# Altium schematic sheet Power.SchDoc
size A
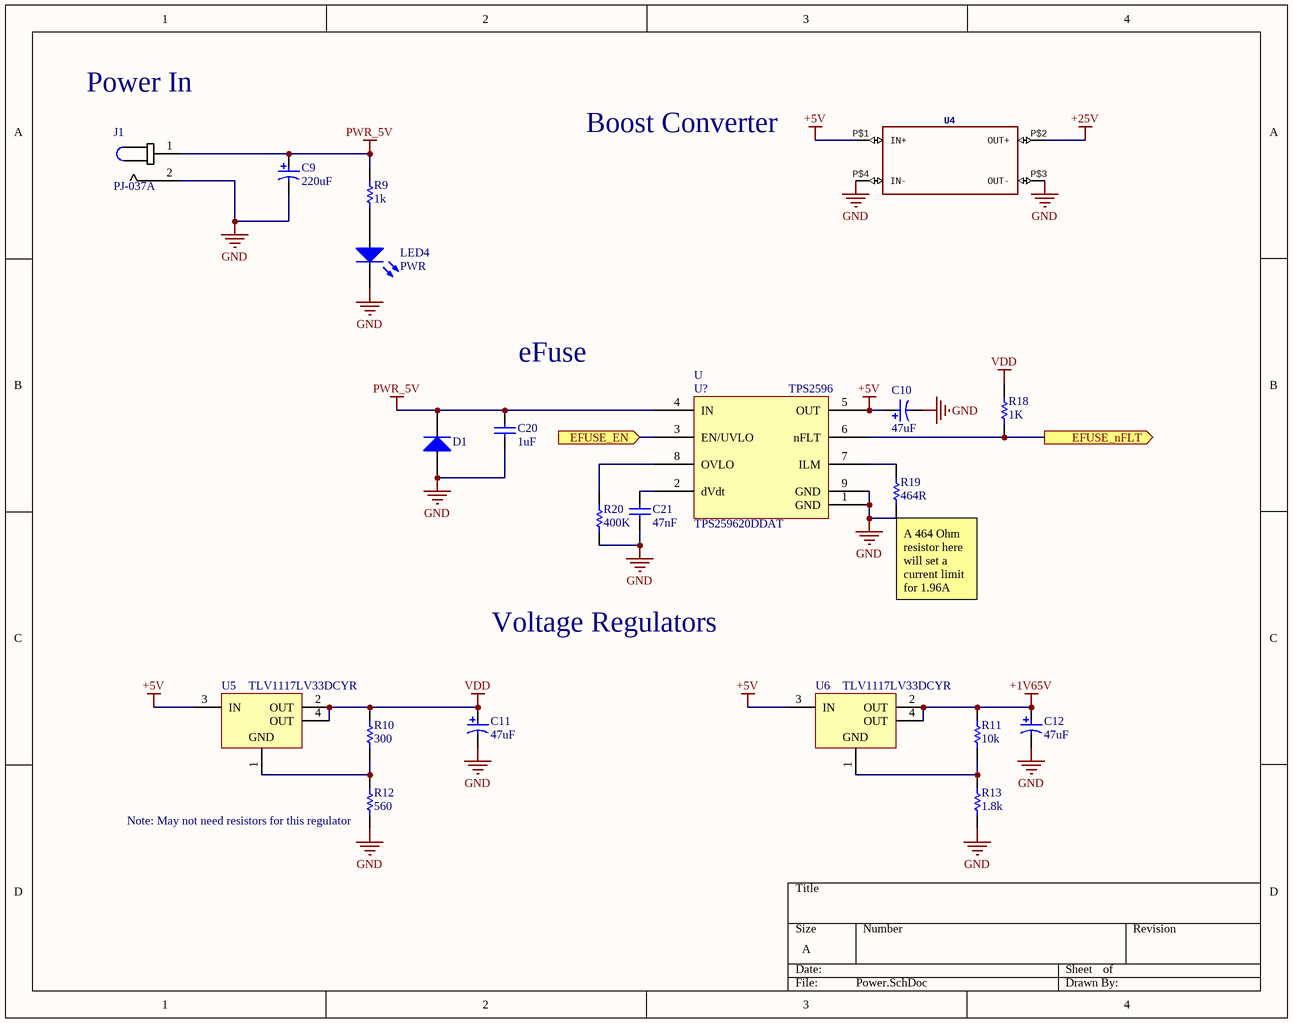
[diagram p0: Power.SchDoc]

## Parts
C9  220uF  [PNSC-FP-V-F_V]
C10  47uF  [PNSC-FP-V-D_V]
C11  47uF  [PNSC-FP-V-D_V]
C12  47uF  [PNSC-FP-V-D_V]
C20  1uF  [CAPC1608X90X20LL10]
C21  47nF  [CAPC1608X90X35ML10T15]
D1  SMAJ5.0A-E3/61  [VISH-DO-214AC-2_M]  (value not drawn)
J1  PJ-037A  [*CUI_PJ-037A]
LED4  PWR  [0805_A]
R9  1k  [RESC1608X55X30LL20T20]
R10  300  [RESC1608X55X30LL15T15]
R11  10k  [RESC1608X55X30LL15T15]
R12  560  [RESC1608X55X30LL20T20]
R13  1.8k  [RESC1609X50X30NL10T20]
R18  1K  [RESC1608X55X30LL15T15]
R19  464R  [RESC1608X55X30LL15T15]
R20  400K  [RESC1608X55X30LL15T15]
U  TPS259620DDAT  [TPS259620DDAT - duplicate]
U4  XL6009E1  [XL6009E1]  (value not drawn)
U5  TLV1117LV33DCYR  [DCY0004A_M]
U6  TLV1117LV33DCYR  [DCY0004A_M]

## Ports
EFUSE_EN (in), EFUSE_nFLT (out)

## Nets
+1V65V: C12.1 R11.2 U6.2(OUT) U6.4(OUT)
+5V: C10.1 U.5(OUT) U4.P$1(IN+) U5.3(IN) U6.3(IN)
+25V: U4.P$2(OUT+)
GND: C9.2 C10.2 C11.2 C12.2 C20.1 C21.1 D1.2(A) J1.2 LED4.1(K) R12.1 R13.2 R19.1 R20.1 U.1(GND) U.9(GND) U4.P$3(OUT-) U4.P$4(IN-)
PWR_5V: C9.1 C20.2 D1.1(K) J1.1 R9.2 U.4(IN)
VDD: C11.1 R10.2 R18.2 U5.2(OUT) U5.4(OUT)
EFUSE_EN: U.3(EN/UVLO) ; port EFUSE_EN
EFUSE_nFLT: R18.1 U.6(nFLT) ; port EFUSE_nFLT
NetC21_2: C21.2 U.2(dVdt)
NetLED4_2: LED4.2(A) R9.1
NetR10_1: R10.1 R12.2 U5.1(GND)
NetR11_1: R11.1 R13.1 U6.1(GND)
NetR19_2: R19.2 U.7(ILM)
NetR20_2: R20.2 U.8(OVLO)

## Notes on the sheet
- Power In
- Boost Converter
- eFuse
- Voltage Regulators
- (near R19) A 464 Ohm resistor here will set a current limit for 1.96A
- (near R12) Note: May not need resistors for this regulator
- (in symbol TI_TPS259620DDAT) U?; TPS2596

## Library data of the parts
C9 = CMP-2000-06215-1: Aluminum Electrolytic Capacitor, 220 uF, +/- 20%, 35 V, 2-Pin SMD (Size Code F), -55 to 105 degC, RoHS, Tape and Reel; Manufacturer: Panasonic; ESR: 0.08ohm; Ripple Current AC: 850mA; Capacitance: 220µF; External Length / Height: 10.2mm; SVHC: ToBeAdvised; Life Time @ Temperature: 2000hours@105°C; Voltage Rating: 35V; Capacitor Case Style: RadialCan-SMD; Leakage Current: 7.7µA; Product Range: PANASONIC-FPSeries; Diameter: 8mm; Datasheet URL: http://industrial.panasonic.com/cdbs/www-data/pdf/RDE0000/ABA0000C1184.pdf; Manufacturer URL: http://www.panasonic.com/; Series: FP; Operating Temperature Max: 105°C; Package Description: 2-Pin Electrolytic Aluminum Capacitor, Body 8.3 x 8.3 mm; Package Reference: FP-V-F; Lifetime @ Temperature: 2000hours@105°C; Operating Temperature Range: -55°Cto+105°C; Package URL: http://industrial.panasonic.com/cdbs/www-data/pdf/RDE0000/DME0000COL48.pdf; Capacitance Tolerance ±: ±20%; AE Capacitor Case: RadialCan-SMD; Height: 10.2mm; Mounting Technology: SurfaceMount; Datasheet Version: 03/2016; Packaging: CutTape; Operating Temperature Min: -55°C; Capacitance Tolerance: ±20%
C10-C12 = CMP-2000-06216-1: Aluminum Electrolytic Capacitor, 47 uF, +/- 20%, 35 V, 2-Pin SMD (Size Code D), -55 to 105 degC, RoHS, Tape and Reel; Manufacturer: Panasonic; Lifetime@Temperature: 2000Hrs@105°C; Capacitance: 47µF; Type: Can; Rated Voltage: 35V; Ripple Current: 300mA; ESR (Equivalent Series Resistance): 0.26O; Package Reference: FP-V-D; Package Description: 2-Pin Electrolytic Aluminum Capacitor, Body 6.6 x 6.6 mm; Datasheet URL: http://industrial.panasonic.com/cdbs/www-data/pdf/RDE0000/ABA0000C1184.pdf; Series: FP; Operating Temp Range: -55to+105°C; Operating Temp-Max: 105°C; Datasheet Version: 03/2016; Manufacturer URL: http://www.panasonic.com/; Package URL: http://industrial.panasonic.com/cdbs/www-data/pdf/RDE0000/DME0000COL48.pdf; Case Size/Dimension: Ø6.3x5.8mm; Mounting Technology: SurfaceMount
C20 = CMP-2000-06025-1: Chip Capacitor, 1 uF, +/- 10%, 50 V, -55 to 85 degC, 0603 (1608 Metric), RoHS, Tape and Reel; Manufacturer: TDK; PCN Part Number: MLCCPartNumberChange30/Nov/2012; Other Names: 445-7468-6; Online Catalog: CSeries,GeneralPurpose; Capacitance: 1µF; Product Training Modules: CSeriesGeneralApplicationsSEAT,CCV,andTVCLDesignToolsGuidetoReplacinganElectrolyticCapacitorwithanMLCC; Voltage - Rated: 50V; Design Resources: 20WNon-IsolatedBuckLEDDriverUsingPLLNK460KG; Temperature Coefficient: X5R; Series: C; Datasheet Version: 08/2016; Package Description: 2-Pin Surface Mount Device, Body 1.6 x 0.8 mm; Mounting Technology: SurfaceMount; Features: -; Size / Dimension: 0.063"Lx0.031"W(1.60mmx0.80mm); Lead Spacing: -; Operating Temperature: -55°C~85°C; Tolerance: ±10%; Height - Seated (Max): -; Mounting Type: SurfaceMount,MLCC; Ratings: -; Standard Package: 1; Applications: GeneralPurpose; Datasheet URL: https://product.tdk.com/info/en/catalog/datasheets/mlcc_commercial_general_en.pdf; Category: Capacitors; Lead Style: -; Packaging: Digi-Reel®; RoHS Information: RoHSCertificate-MLCC; Package / Case: 0603(1608Metric); Package Reference: 0603; Manufacturer URL: http://www.tdk.com/; Thickness (Max): 0.035"(0.90mm); Family: CeramicCapacitors
C21 = CMP-2006-02927-1: Manufacturer: Murata; Part Number: GRM188R71H473KA61D
D1 = CMP-0548-00235-2: Transient Voltage Suppressor, 6.40 to 231 V, 5 V Stand-off Voltage, Uni-Directional, -55 to 155 degC, 2-pin DO-214AC, Pb-Free, Tape and Reel; Manufacturer: Vishay Semiconductor; ID (uA): 800; VBR Uni-Directional (V): 6.4 to 231; IFSM: 40 A; PPPM (W): 400, 300; VWM (V): 5; PackageReference: DO-214AC-2; ComponentLink2URL: http://www.vishay.com/docs/88390/smaj50a.pdf; Operating Junction and Storage Temperature Range: -55 to 150 degC; ComponentLink1Description: Manufacturer URL; PackageDescription: 2-Pin DO-214AC (SMA), Body 4.245 x 2.665 mm; ComponentLink2Description: Datasheet; ComponentLink3URL: http://www.vishay.com/docs/88390/smaj50a.pdf; ComponentLink3Description: Package Specification; RoHS: TRUE; PartNumber: SMAJ5.0A-E3/61; Mounting Technology: Surface Mount; ComponentLink1URL: http://www.vishay.com/; Packing: Tape and Reel; DatasheetVersion: 12/8/2013
LED4 = CMP-1426-00010-1: SMD mono-color Chip LED, WL-SMCW, Super Red; Manufacturer: Wuerth Elektronik; PartNumber: 150080SS75000; PackageReference: 0805_A; ComponentLink2URL: http://katalog.we-online.com/led/datasheet/150080SS75000.pdf; ComponentLink1URL: http://www.we-online.com; Color: Super Red; ComponentLink2Description: Datasheet; ComponentLink1Description: Manufacturer URL
R9 = CMP-2000-00873-1: Manufacturer: Panasonic; Part Number: ERA3AEB102V
R10 R11 R18-R20 = CMP-2000-00411-1: Manufacturer: Panasonic; Part Number: ERJ-3EKF3000V
R12 = CMP-2000-00091-1: Part Number: ERA3AEB561V; Manufacturer: Panasonic
R13 = CMP-2000-03824-1: Manufacturer: Vishay Dale; Part Number: CRCW0603100RFKEA
U = TI_TPS259620DDAT: Texas Instruments TPS259620DDAT; ComponentLink1Description: TI Link; ComponentLink1URL: http://www.ti.com/product/TPS2596
U4 = XL6009E1: GateName_1: G$1; SymbolName_1: XL6009E1; LibraryName: VFD-Clock; DeviceSetName: XL6009E1; Package: XL6009E1
U5 U6 = CMP-0395-00503-2: Single Output LDO, 1 A, Fixed 3.3 V Output, 2 to 5.5 V Input, 4-pin SOT-223 (DCY), -40 to 125 degC, Green (RoHS & no Sb/Br); Manufacturer: Texas Instruments; Vout Adj(Min)(V): 3.3; Vdo(Typ)(mV): 1200; Iq(Typ)(mA): 0.05; Accuracy(%): 2; Iout(Max)(A): 1; SubFamily: Single Channel LDO; Vin(Max)(V): 5.5; PackageReference: DCY0004A; PackageDescription: 4-Pin Plastic Small Outline, Body 3.5 x 6.5 mm, Pitch 2.3 mm; Vout Adj(Max)(V): 3.3; Mounting Technology: Surface Mount; ComponentLink2Description: Datasheet; ComponentLink1Description: Manufacturer URL; PartNumber: TLV1117LV33DCYR; ComponentLink3Description: Package Specification; ComponentLink1URL: http://www.ti.com/; ComponentLink2URL: http://www.ti.com/general/docs/lit/getliterature.tsp?genericPartNumber=TLV1117LV33&fileType=pdf; Fixed Output Options(V): 3.3; PackageVersion: 4202506/B; Vin(Min)(V): 2; DatasheetVersion: SBVS160A; Eco-Plan: Green (RoHS & no Sb/Br); ComponentLink3URL: http://www.ti.com/litv/pdf/mpds094a; Code_JEDEC: TO-261
J1 = PJ-037A: Value: *